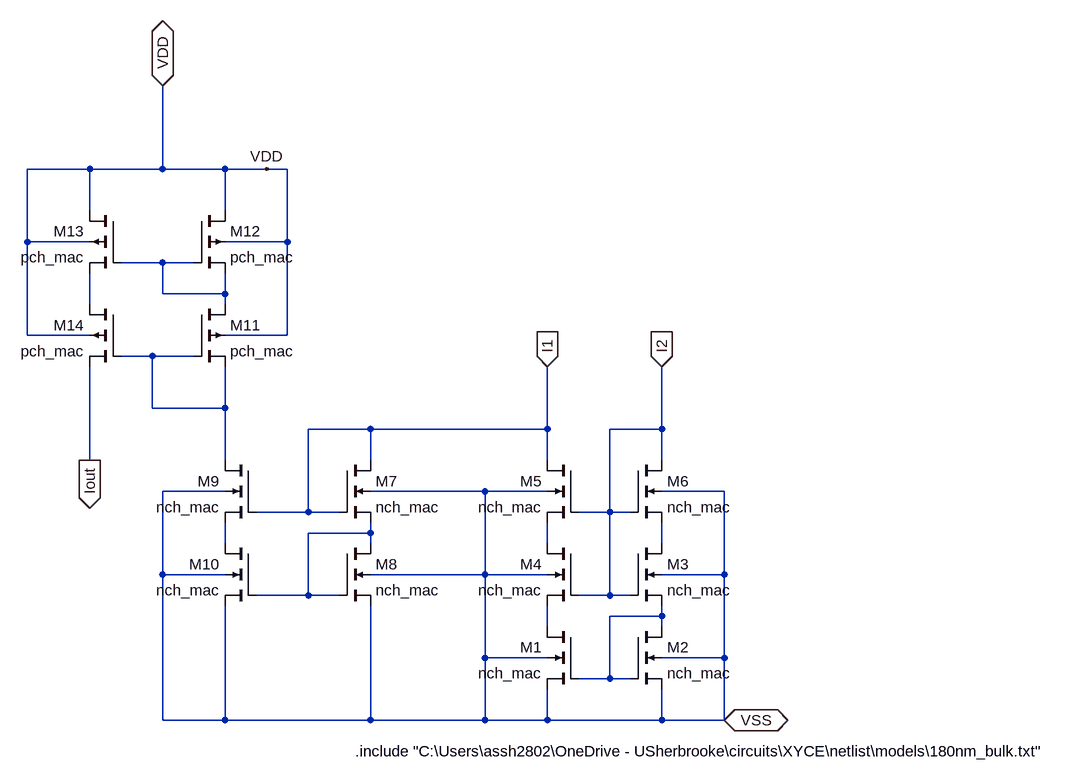
[diagram p0: schematic CurrentSubtractor.asc]
CurrentSubtractor.asc, the LTspice schematic file:
Version 4
SHEET 1 1052 680
WIRE -560 -352 -656 -352
WIRE -448 -352 -448 -480
WIRE -448 -352 -560 -352
WIRE -352 -352 -448 -352
WIRE -288 -352 -352 -352
WIRE -256 -352 -288 -352
WIRE -560 -288 -560 -352
WIRE -352 -288 -352 -352
WIRE -656 -240 -656 -352
WIRE -560 -240 -656 -240
WIRE -256 -240 -256 -352
WIRE -256 -240 -352 -240
WIRE -448 -208 -512 -208
WIRE -400 -208 -448 -208
WIRE -448 -160 -448 -208
WIRE -352 -160 -352 -192
WIRE -352 -160 -448 -160
WIRE -560 -144 -560 -192
WIRE -352 -144 -352 -160
WIRE -656 -96 -656 -240
WIRE -560 -96 -656 -96
WIRE -256 -96 -256 -240
WIRE -256 -96 -352 -96
WIRE -464 -64 -512 -64
WIRE -400 -64 -464 -64
WIRE -464 16 -464 -64
WIRE -352 16 -352 -48
WIRE -352 16 -464 16
WIRE -128 48 -224 48
WIRE 144 48 144 -48
WIRE 144 48 -128 48
WIRE 320 48 320 -48
WIRE 320 48 240 48
WIRE -560 96 -560 -48
WIRE -352 96 -352 16
WIRE -128 96 -128 48
WIRE 144 96 144 48
WIRE 320 96 320 48
WIRE -352 144 -448 144
WIRE 48 144 -128 144
WIRE 144 144 48 144
WIRE 416 144 320 144
WIRE -224 176 -224 48
WIRE -224 176 -304 176
WIRE -176 176 -224 176
WIRE 240 176 240 48
WIRE 240 176 192 176
WIRE 272 176 240 176
WIRE -128 208 -128 192
WIRE -128 208 -224 208
WIRE -352 224 -352 192
WIRE -128 224 -128 208
WIRE 144 224 144 192
WIRE 320 224 320 192
WIRE -448 272 -448 144
WIRE -352 272 -448 272
WIRE 48 272 48 144
WIRE 48 272 -128 272
WIRE 144 272 48 272
WIRE 416 272 416 144
WIRE 416 272 320 272
WIRE -224 304 -224 208
WIRE -224 304 -304 304
WIRE -176 304 -224 304
WIRE 240 304 240 176
WIRE 240 304 192 304
WIRE 272 304 240 304
WIRE 320 336 320 320
WIRE 320 336 240 336
WIRE 144 352 144 320
WIRE 320 352 320 336
WIRE 48 400 48 272
WIRE 144 400 48 400
WIRE 416 400 416 272
WIRE 416 400 320 400
WIRE 240 432 240 336
WIRE 240 432 192 432
WIRE 272 432 240 432
WIRE -448 496 -448 272
WIRE -352 496 -352 320
WIRE -352 496 -448 496
WIRE -128 496 -128 320
WIRE -128 496 -352 496
WIRE 48 496 48 400
WIRE 48 496 -128 496
WIRE 144 496 144 448
WIRE 144 496 48 496
WIRE 320 496 320 448
WIRE 320 496 144 496
WIRE 416 496 416 400
WIRE 416 496 320 496
FLAG 144 -48 I1
IOPIN 144 -48 In
FLAG 320 -48 I2
IOPIN 320 -48 In
FLAG -560 96 Iout
IOPIN -560 96 Out
FLAG -448 -480 VDD
IOPIN -448 -480 BiDir
FLAG 416 496 VSS
IOPIN 416 496 BiDir
FLAG -288 -352 VDD
SYMBOL nmos4 192 352 M0
SYMATTR InstName M1
SYMATTR Value nch_mac
SYMATTR Value2 l=180n w=5u
SYMBOL nmos4 272 352 R0
SYMATTR InstName M2
SYMATTR Value nch_mac
SYMATTR Value2 l=180n w=5u
SYMBOL nmos4 272 224 R0
SYMATTR InstName M3
SYMATTR Value nch_mac
SYMATTR Value2 l=180n w=5u m=2
SYMBOL nmos4 192 224 M0
SYMATTR InstName M4
SYMATTR Value nch_mac
SYMATTR Value2 l=180n w=5u m=2
SYMBOL nmos4 192 96 M0
SYMATTR InstName M5
SYMATTR Value nch_mac
SYMATTR Value2 l=180n w=5u
SYMBOL nmos4 272 96 R0
SYMATTR InstName M6
SYMATTR Value nch_mac
SYMATTR Value2 l=180n w=5u
SYMBOL nmos4 -176 96 R0
SYMATTR InstName M7
SYMATTR Value nch_mac
SYMATTR Value2 l=180n w=5u
SYMBOL nmos4 -176 224 R0
SYMATTR InstName M8
SYMATTR Value nch_mac
SYMATTR Value2 l=180n w=5u
SYMBOL nmos4 -304 96 M0
SYMATTR InstName M9
SYMATTR Value nch_mac
SYMATTR Value2 l=180n w=5u
SYMBOL nmos4 -304 224 M0
SYMATTR InstName M10
SYMATTR Value nch_mac
SYMATTR Value2 l=180n w=5u
SYMBOL pmos4 -400 -144 R0
SYMATTR InstName M11
SYMATTR Value pch_mac
SYMATTR Value2 l=180n w=1u
SYMBOL pmos4 -400 -288 R0
SYMATTR InstName M12
SYMATTR Value pch_mac
SYMATTR Value2 l=180n w=1u
SYMBOL pmos4 -512 -288 M0
SYMATTR InstName M13
SYMATTR Value pch_mac
SYMATTR Value2 l=180n w=1u
SYMBOL pmos4 -512 -144 M0
SYMATTR InstName M14
SYMATTR Value pch_mac
SYMATTR Value2 l=180n w=1u
TEXT -152 544 Left 0 !.include "C:\\Users\\assh2802\\OneDrive - USherbrooke\\circuits\\XYCE\\netlist\\models\\180nm_bulk.txt"

The netlist it stands for:
* CurrentSubtractor.asc
M1 N009 N008 VSS VSS nch_mac l=180n w=5u
M2 N008 N008 VSS VSS nch_mac l=180n w=5u
M3 N007 I2 N008 VSS nch_mac l=180n w=5u m=2
M4 N006 I2 N009 VSS nch_mac l=180n w=5u m=2
M5 I1 I2 N006 VSS nch_mac l=180n w=5u
M6 I2 I2 N007 VSS nch_mac l=180n w=5u
M7 I1 I1 N004 VSS nch_mac l=180n w=5u
M8 N004 N004 VSS VSS nch_mac l=180n w=5u
M9 N003 I1 N005 VSS nch_mac l=180n w=5u
M10 N005 N004 VSS VSS nch_mac l=180n w=5u
M11 N001 N003 N003 VDD pch_mac l=180n w=1u
M12 VDD N001 N001 VDD pch_mac l=180n w=1u
M13 VDD N001 N002 VDD pch_mac l=180n w=1u
M14 N002 N003 Iout VDD pch_mac l=180n w=1u
.model NMOS NMOS
.model PMOS PMOS
.lib standard.mos
.include "C:\Users\assh2802\OneDrive - USherbrooke\circuits\XYCE\netlist\models\180nm_bulk.txt"
.backanno
.end